# EAGLE design EL2 (EAGLE 9.6.2)
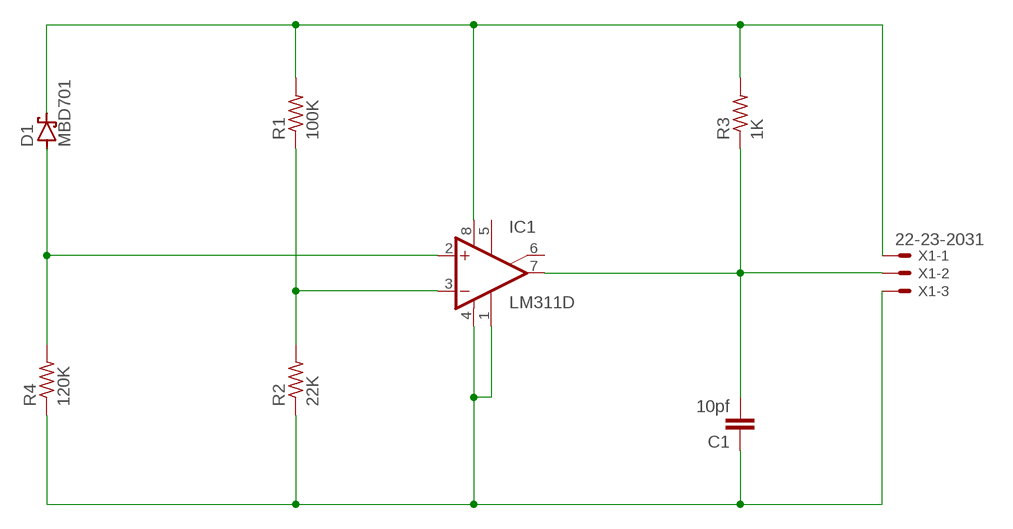
[diagram p0: schematic, sheet 1]

## Parts
C1  10pf  C-EUC0603  [C0603]
D1  MBD701  [TO92H]
IC1  LM311D  [SO08]
R1  100K  R-US_R0603  [R0603]
R2  22K  R-US_R0603  [R0603]
R3  1K  R-US_R0603  [R0603]
R4  120K  R-US_R0603  [R0603]
X1  22-23-2031  [22-23-2031]

## Nets
N$1: D1.2(C) IC1.8(V+) R1.2 R3.2 X1.1
N$2: C1.1 IC1.1(GND) IC1.4(V-) R2.1 R4.1 X1.3
N$3: D1.1(A) IC1.2(+IN) R4.2
N$4: IC1.3(-IN) R1.1 R2.2
N$5: C1.2 IC1.7(OUT) R3.1 X1.2
Unconnected: IC1.5(ON) IC1.6(ON/STR)

## Library data of the parts
C1 = rcl:C-EU: CAPACITOR, European symbol; SPICEPREFIX: C
D1 = diode:MBD701: UHF DIODE
IC1 = linear:LM311: COMPARATOR
R1-R4 = rcl:R-US_: RESISTOR, American symbol; SPICEPREFIX: R
X1 = con-molex:22-23-2031: .100" (2.54mm) Center Header - 3 Pin; MF: MOLEX; MPN: 22-23-2031; OC_FARNELL: 1462950; OC_NEWARK: 30C0862

## Board
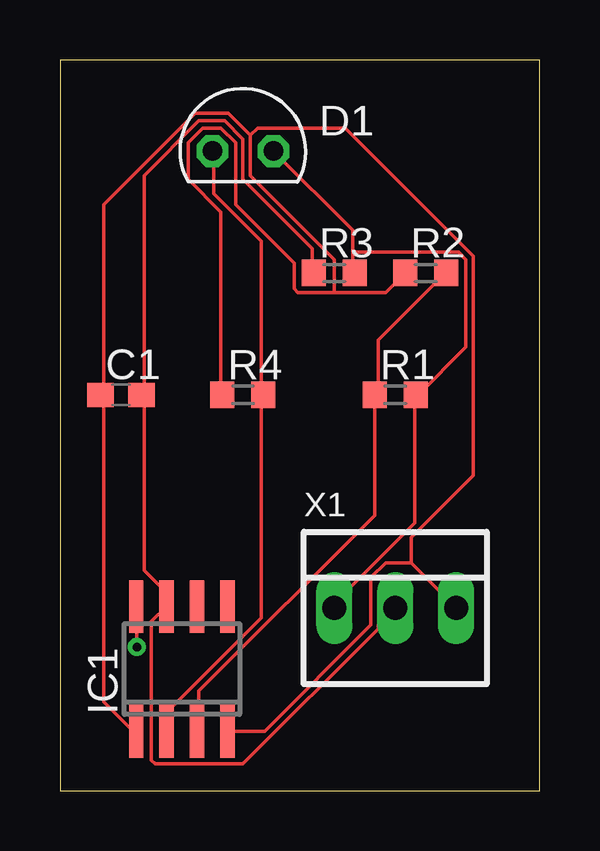
[diagram p1: board, top side]
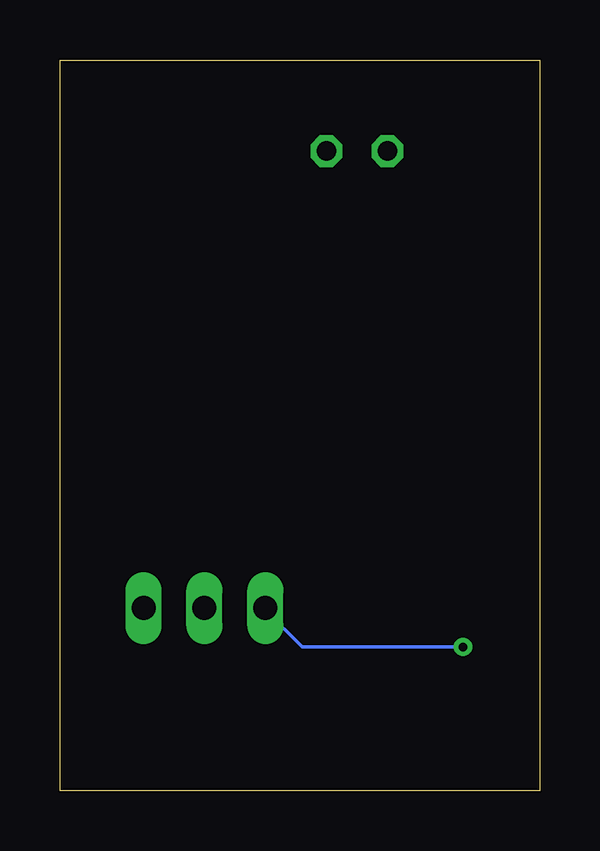
[diagram p2: board, bottom side, seen from below]

Size 19.99 x 30.47 mm. Coordinates in mm from the lower left corner, seen from the top.
Outline: 0,0 19.99,0 19.99,30.47 0,30.47 0,0
Copper layers (1*16): Top 0.035mm / dielectric 1.5mm / Bottom 0.035mm
Design rules "default": minimum track width 6mil, minimum drill 0.35mm, track to track 6mil, track to pad 6mil, pad to pad 6mil, via to via 6mil, smd to smd 6mil, copper to edge 40mil, drill to drill 6mil, minimum pad ring 10mil, minimum via ring 8mil, stop-mask expansion 4mil, vias tented up to drill 0mil, thermal gap 10mil

### Footprints (pad centres in the part's own frame; a part is rotated, then mirrored left to right if it is on the bottom)
C0603 = smd 1.1 x 1: 1 -0.85,0; 2 0.85,0
TO92H = drill 0.813 octagon: 1 -1.27,0; 2 1.27,0
SO08 = smd 0.6 x 2.2: 1 -1.905,-2.6; 2 -0.635,-2.6; 3 0.635,-2.6; 4 1.905,-2.6; 5 1.905,2.6; 6 0.635,2.6; 7 -0.635,2.6; 8 -1.905,2.6
R0603 = smd 1 x 1.1: 1 -0.85,0; 2 0.85,0
22-23-2031 = drill 1 long: 1 -2.54,0; 2 0,0; 3 2.54,0

### Placement (x,y rotation side)
C1  2.54,16.51 0 top
D1  7.62,26.67 0 top
IC1  5.08,5.08 0 top
R1  13.97,16.51 0 top
R2  15.24,21.59 0 top
R3  11.43,21.59 0 top
R4  7.62,16.51 0 top
X1  13.97,7.62 0 top

### Tracks (layer width: path | path; a pad name or v marks a point on that pad's centre or on a via)
N$1  (via drill 0.35)
  Top 0.152: 12.19,22.45 12.19,23.37 D1.2 | 12.19,22.45 12.19,21.69 R3.2 | X1.1 11.43,7.82 14.78,11.18 14.78,16.51 R1.2 14.93,16.51 16.92,18.49 16.92,22.15 16.61,22.45 12.19,22.45 | v3.2,5.99 3.2,7.67 IC1.8
  Bottom 0.152: v3.2,5.99 9.91,5.99 11.43,7.52 X1.1
N$2
  Top 0.152: 14.63,9.5 13.56,9.5 12.95,8.89 12.95,6.91 8.53,2.49 7.01,2.49 IC1.4 | X1.3 14.63,9.5 | 1.83,16.51 1.83,3.71 3.05,2.49 IC1.1 | 11.43,20.78 13.56,20.78 14.33,21.54 R2.1 | 11.43,20.78 9.91,20.78 9.75,20.93 9.75,22 7.31,24.44 7.31,27.03 6.71,27.63 5.94,27.63 5.33,27.03 5.33,25.5 6.71,24.13 6.71,16.51 R4.1 | 1.83,16.51 1.83,24.44 5.64,28.25 7.01,28.25 7.92,27.33 | 7.92,27.33 7.92,25.65 11.43,22.15 11.43,20.78 | 1.83,16.51 C1.1 | 14.63,9.5 14.63,10.57 17.22,13.16 17.22,22.3 11.89,27.63 8.23,27.63 7.92,27.33
N$3
  Top 0.152: 8.38,16.51 8.38,22.91 6.4,24.89 6.4,26.57 D1.1 | 8.38,16.51 8.38,7.21 4.57,3.4 4.57,2.49 IC1.2 | 8.38,16.51 R4.2
N$4
  Top 0.152: R2.2 16,21.54 13.26,18.8 13.26,16.51 R1.1 13.11,16.51 13.11,11.48 5.79,4.17 5.79,2.49 IC1.3
N$5
  Top 0.152: 3.5,16.51 3.5,9.2 4.42,8.28 4.42,7.82 IC1.7 4.42,7.67 3.81,7.06 3.81,1.27 3.96,1.12 7.62,1.12 13.26,6.76 13.26,6.91 X1.2 | 3.5,16.51 3.5,25.65 5.79,27.94 6.86,27.94 7.62,27.18 7.62,25.5 10.52,22.61 10.52,21.69 R3.1 | 3.5,16.51 C1.2